# EAGLE design TestV2 (EAGLE 9.2.2)

## Sheet 1 of 8: Light Sensor Circuit
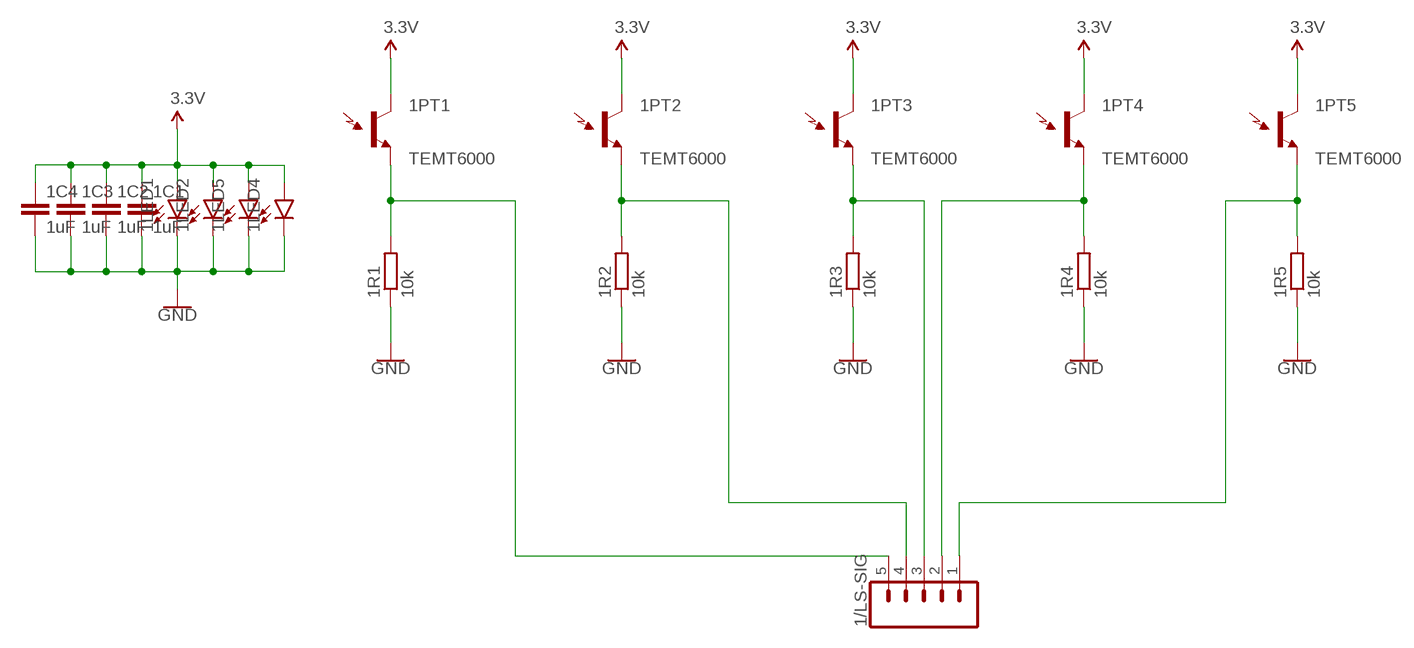
[diagram p0: schematic, sheet 1]

### Parts
1/LS-SIG  CONN_05LOCK  [1X05_LOCK]
1C1  1uF  C-EUC0603  [C0603]
1C2  1uF  C-EUC0603  [C0603]
1C3  1uF  C-EUC0603  [C0603]
1C4  1uF  C-EUC0603  [C0603]
1LED1  3528LED  [3528]
1LED2  3528LED  [3528]
1LED4  3528LED  [3528]
1LED5  3528LED  [3528]
1PT1  TEMT6000  LIGHT_SENSORTEMT6000  [TEMT6000]
1PT2  TEMT6000  LIGHT_SENSORTEMT6000  [TEMT6000]
1PT3  TEMT6000  LIGHT_SENSORTEMT6000  [TEMT6000]
1PT4  TEMT6000  LIGHT_SENSORTEMT6000  [TEMT6000]
1PT5  TEMT6000  LIGHT_SENSORTEMT6000  [TEMT6000]
1R1  10k  R-EU_R0603  [R0603]
1R2  10k  R-EU_R0603  [R0603]
1R3  10k  R-EU_R0603  [R0603]
1R4  10k  R-EU_R0603  [R0603]
1R5  10k  R-EU_R0603  [R0603]

### Nets
3.3V: 1C1.1 1C2.1 1C3.1 1C4.1 1LED1.A 1LED2.A 1LED4.A 1LED5.A 1PT1.COLLECTOR(C1) 1PT2.COLLECTOR(C1) 1PT3.COLLECTOR(C1) 1PT4.COLLECTOR(C1) 1PT5.COLLECTOR(C1) ; also sheet 2,3,5,6,7,8
GND: 1C1.2 1C2.2 1C3.2 1C4.2 1LED1.C 1LED2.C 1LED4.C 1LED5.C 1R1.1 1R2.1 1R3.1 1R4.1 1R5.1 ; also sheet 2,3,4,5,6,7,8
N$65: 1/LS-SIG.4 1PT2.EMITTER(E1) 1R2.2
N$66: 1/LS-SIG.3 1PT3.EMITTER(E1) 1R3.2
N$67: 1/LS-SIG.2 1PT4.EMITTER(E1) 1R4.2
N$68: 1/LS-SIG.1 1PT5.EMITTER(E1) 1R5.2
N$69: 1/LS-SIG.5 1PT1.EMITTER(E1) 1R1.2

## Sheet 2 of 8: TPS5450 Buck Circuit
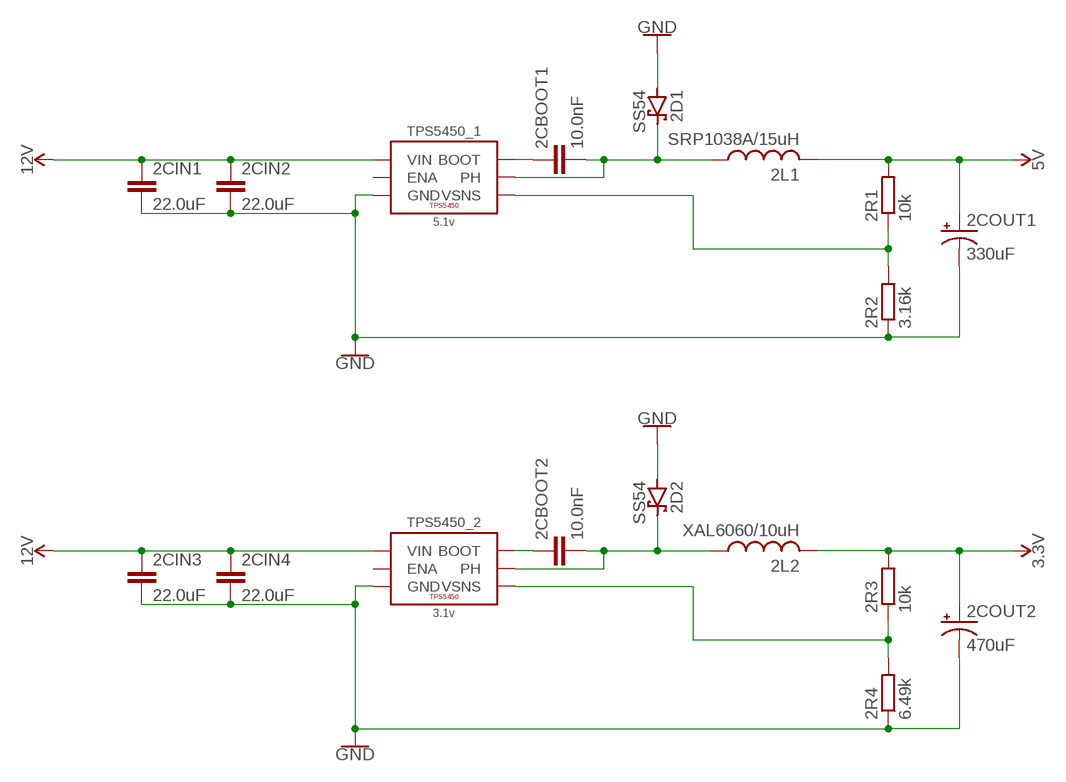
[diagram p1: schematic, sheet 2]

### Parts
2CBOOT1  10.0nF  C-EUC0603  [C0603]
2CBOOT2  10.0nF  C-EUC0603  [C0603]
2CIN1  22.0uF  C-EUC1210  [C1210]
2CIN2  22.0uF  C-EUC1210  [C1210]
2CIN3  22.0uF  C-EUC1210  [C1210]
2CIN4  22.0uF  C-EUC1210  [C1210]
2COUT1  330uF  CPOL-USD/7343-31R  [D/7343-31R]
2COUT2  470uF  CPOL-USD/7343-31R  [D/7343-31R]
2D1  SS54  SCHOTTKY-DIODESMD  [SMB]
2D2  SS54  SCHOTTKY-DIODESMD  [SMB]
2L1  SRP1038A/15uH  SRP1038A  [SRP1038A]
2L2  XAL6060/10uH  XAL6060  [XAL6060]
2R1  10k  R-EU_R0603  [R0603]
2R2  3.16k  R-EU_R0603  [R0603]
2R3  10k  R-EU_R0603  [R0603]
2R4  6.49k  R-EU_R0603  [R0603]
TPS5450_1  5.1v  TPS5450  [POWERPAD-SOIC-8]
TPS5450_2  3.1v  TPS5450  [POWERPAD-SOIC-8]

### Nets
3.3V: 2COUT2.+ 2L2.2 2R3.2 ; also sheet 1,3,5,6,7,8
5V: 2COUT1.+ 2L1.2 2R1.2 ; also sheet 3,6,8
12V: 2CIN1.1 2CIN2.1 2CIN3.1 2CIN4.1 TPS5450_1.7(VIN) TPS5450_2.7(VIN) ; also sheet 3,4,5,8
GND: 2CIN1.2 2CIN2.2 2CIN3.2 2CIN4.2 2COUT1.- 2COUT2.- 2D1.A 2D2.A 2R2.1 2R4.1 TPS5450_1.6(GND) TPS5450_1.9(GND) TPS5450_1.P$1(GND) TPS5450_1.P$2(GND) TPS5450_1.P$3(GND) TPS5450_1.P$4(GND) TPS5450_1.P$5(GND) TPS5450_1.P$6(GND) TPS5450_2.6(GND) TPS5450_2.9(GND) TPS5450_2.P$1(GND) TPS5450_2.P$2(GND) TPS5450_2.P$3(GND) TPS5450_2.P$4(GND) TPS5450_2.P$5(GND) TPS5450_2.P$6(GND) ; also sheet 1,3,4,5,6,7,8
N$1: 2CBOOT1.2 2D1.C 2L1.1 TPS5450_1.8(PH)
N$2: 2CBOOT2.1 TPS5450_2.1(BOOT)
N$3: 2CBOOT1.1 TPS5450_1.1(BOOT)
N$4: 2R1.1 2R2.2 TPS5450_1.4(VSNS)
N$5: 2CBOOT2.2 2D2.C 2L2.1 TPS5450_2.8(PH)
N$6: 2R3.1 2R4.2 TPS5450_2.4(VSNS)
Unconnected: TPS5450_1.2(NC) TPS5450_1.3(NC) TPS5450_1.5(ENA) TPS5450_2.2(NC) TPS5450_2.3(NC) TPS5450_2.5(ENA)

## Sheet 3 of 8: MAX1522 Boost Converter Circuit
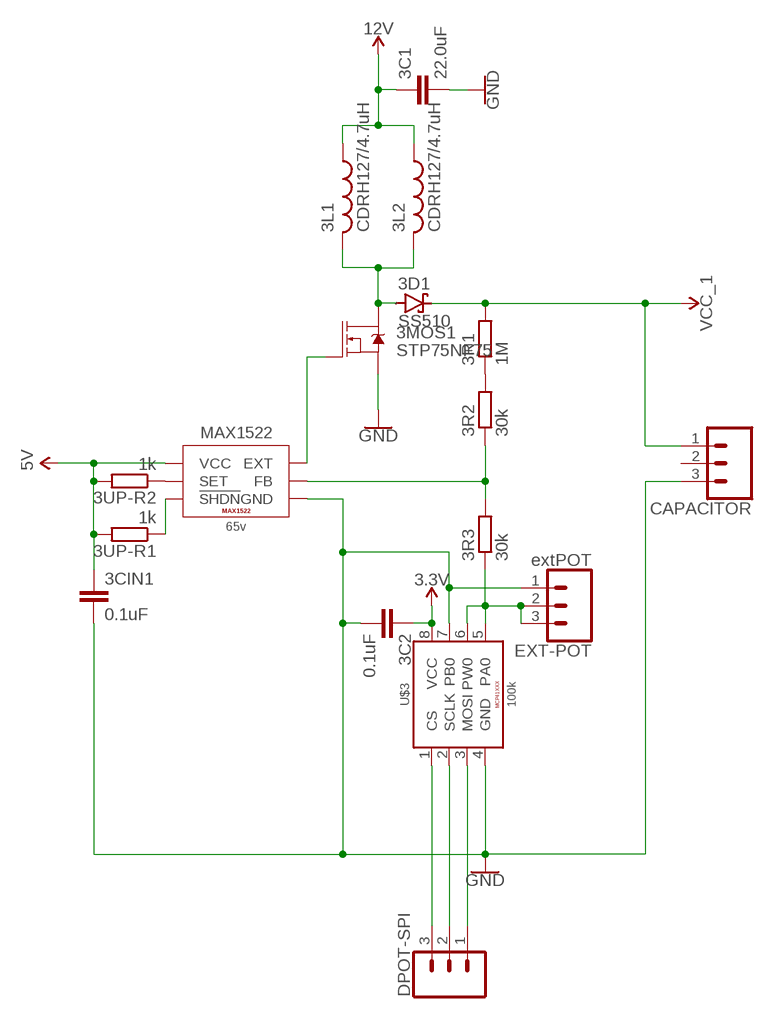
[diagram p2: schematic, sheet 3]

### Parts
3C1  22.0uF  C-EUC1210  [C1210]
3C2  0.1uF  C-EUC0603  [C0603]
3CIN1  0.1uF  C-EUC0603  [C0603]
3D1  SS510  SCHOTTKY-DIODESMD  [SMB]
3L1  CDRH127/4.7uH  CDRH127  [127]
3L2  CDRH127/4.7uH  CDRH127  [127]
3MOS1  STP75NF75  MOSFET-NCH-FQP30N06L  [TO220V]
3R1  1M  R-EU_R0603  [R0603]
3R2  30k  R-EU_R0603  [R0603]
3R3  30k  R-EU_R0603  [R0603]
3UP-R1  1k  R-EU_R0603  [R0603]
3UP-R2  1k  R-EU_R0603  [R0603]
CAPACITOR  CONN_03-SCREW-5MM  [SCREWTERMINAL-5MM-3]
DPOT-SPI  CONN_03LOCK  [1X03_LOCK]
EXT-POT  extPOT  CONN_03  [1X03]
MAX1522  65v  MAX1522EUT+T  [SOT23-6]
U$3  100k  MCP41XXX  [SOIC-8]

### Nets
3.3V: 3C2.1 U$3.8(VCC) ; also sheet 1,2,5,6,7,8
5V: 3CIN1.1 3UP-R1.2 3UP-R2.2 MAX1522.6(VCC) ; also sheet 2,6,8
12V: 3C1.1 3L1.1 3L2.1 ; also sheet 2,4,5,8
GND: 3C1.2 3C2.2 3CIN1.2 3MOS1.3(S) CAPACITOR.3 EXT-POT.1 MAX1522.1(GND) U$3.4(GND) U$3.7(PB0) ; also sheet 1,2,4,5,6,7,8
N$7: 3R1.1 3R2.2
N$8: 3R2.1 3R3.2 MAX1522.2(FB)
N$9: 3MOS1.1(G) MAX1522.5(EXT)
N$10: 3R3.1 EXT-POT.2 EXT-POT.3 U$3.5(PA0) U$3.6(PW0)
N$11: 3D1.A 3L1.2 3L2.2 3MOS1.2(D)
N$25: 3UP-R1.1 MAX1522.4(!SHDN)
N$29: 3UP-R2.1 MAX1522.3(SET)
N$37: DPOT-SPI.3 U$3.1(CS)
N$38: DPOT-SPI.2 U$3.2(SCLK)
N$39: DPOT-SPI.1 U$3.3(MOSI)
VCC_1: 3D1.C 3R1.2 CAPACITOR.1 ; also sheet 4
Unconnected: CAPACITOR.2

## Sheet 4 of 8: Solenoid MOSFET Switch Circuit
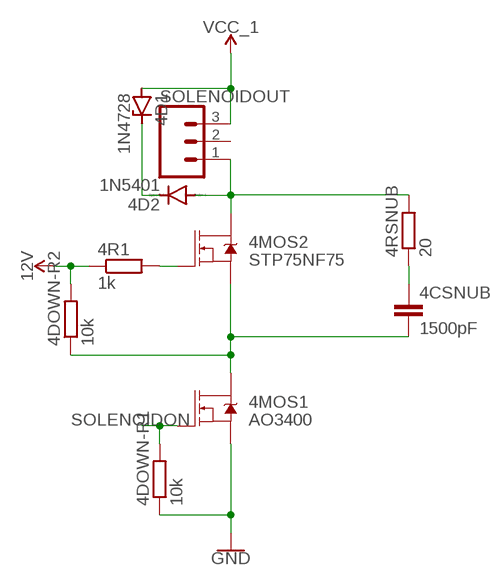
[diagram p3: schematic, sheet 4]

### Parts
4CSNUB  1500pF  C-EUC0603  [C0603]
4D1  1N4728  [DO41Z10]
4D2  1N5401  1N5400  [DO201-15]
4DOWN-R1  10k  R-EU_R0603  [R0603]
4DOWN-R2  10k  R-EU_R0603  [R0603]
4MOS1  AO3400  MOSFET-NCH-AO3404A  [SOT23-3]
4MOS2  STP75NF75  MOSFET-NCH-FQP30N06L  [TO220V]
4R1  1k  R-EU_R0603  [R0603]
4RSNUB  20  R-EU_R0603  [R0603]
SOLENOIDOUT  CONN_03-SCREW-5MM  [SCREWTERMINAL-5MM-3]

### Nets
12V: 4DOWN-R2.2 4R1.1 ; also sheet 2,3,5,8
GND: 4DOWN-R1.1 4MOS1.2(S) ; also sheet 1,2,3,5,6,7,8
N$22: 4CSNUB.2 4DOWN-R2.1 4MOS1.3(D) 4MOS2.3(S)
N$23: 4MOS2.1(G) 4R1.2
N$24: 4D1.C 4D2.C
N$26: 4CSNUB.1 4RSNUB.1
SOLENOID-: 4D2.A 4MOS2.2(D) 4RSNUB.2 SOLENOIDOUT.1
SOLENOIDON: 4DOWN-R1.2 4MOS1.1(G) ; also sheet 5
VCC_1: 4D1.A SOLENOIDOUT.3 ; also sheet 3
Unconnected: SOLENOIDOUT.2

## Sheet 5 of 8: VNH5050 Motor Driver Circuit
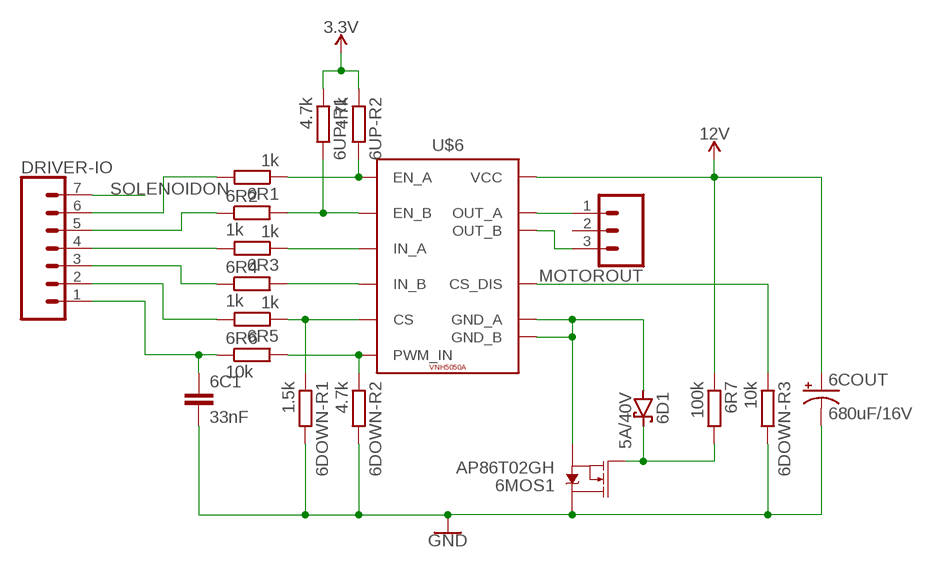
[diagram p4: schematic, sheet 5]

### Parts
6C1  33nF  C-EUC0603  [C0603]
6COUT  680uF/16V  CPOL-USE3.5-8  [E3,5-8]
6D1  5A/40V  SCHOTTKY-DIODESMD  [SMB]
6DOWN-R1  1.5k  R-EU_R0603  [R0603]
6DOWN-R2  4.7k  R-EU_R0603  [R0603]
6DOWN-R3  10k  R-EU_R0603  [R0603]
6MOS1  AP86T02GH  MOSFET-NCH-FDD8780  [DPAK]
6R1  1k  R-EU_R0603  [R0603]
6R2  1k  R-EU_R0603  [R0603]
6R3  1k  R-EU_R0603  [R0603]
6R4  1k  R-EU_R0603  [R0603]
6R5  1k  R-EU_R0603  [R0603]
6R6  10k  R-EU_R0603  [R0603]
6R7  100k  R-EU_R0603  [R0603]
6UP-R1  4.7k  R-EU_R0603  [R0603]
6UP-R2  4.7k  R-EU_R0603  [R0603]
DRIVER-IO  CONN_07LOCK  [1X07_LOCK]
MOTOROUT  CONN_03-SCREW-5MM  [SCREWTERMINAL-5MM-3]
U$6  VNH5050A  [POWERSSO-36]

### Nets
3.3V: 6UP-R1.1 6UP-R2.1 ; also sheet 1,2,3,6,7,8
12V: 6COUT.+ 6R7.1 U$6.1(VCC) U$6.P13(VCC) U$6.P24(VCC) U$6.P$13(VCC) U$6.P$14(VCC) U$6.P$15(VCC) U$6.P$16(VCC) U$6.P$17(VCC) U$6.P$18(VCC) U$6.P$19(VCC) U$6.P$20(VCC) U$6.P$21(VCC) U$6.P$22(VCC) U$6.P$23(VCC) U$6.P$24(VCC) ; also sheet 2,3,4,8
CS: 6R5.2 DRIVER-IO.2
EN_A: 6R1.2 DRIVER-IO.6
EN_B: 6R2.1 DRIVER-IO.5
GND: 6C1.2 6COUT.- 6DOWN-R1.2 6DOWN-R2.2 6DOWN-R3.2 6MOS1.4(D) ; also sheet 1,2,3,4,6,7,8
IN_A: 6R3.2 DRIVER-IO.4
IN_B: 6R4.1 DRIVER-IO.3
N$12: 6R1.1 6UP-R2.2 U$6.P16(EN_A)
N$13: 6R3.1 U$6.P15(IN_A)
N$14: 6R2.2 6UP-R1.2 U$6.P21(EN_B)
N$15: 6R4.2 U$6.P22(IN_B)
N$16: 6DOWN-R2.1 6R6.2 U$6.P17(PWM_IN)
N$17: 6DOWN-R1.1 6R5.1 U$6.P19(CS)
N$19: 6D1.A 6MOS1.3(S) U$6.P1(GND_A) U$6.P3(GND_A) U$6.P4(GND_A) U$6.P5(GND_A) U$6.P6(GND_A) U$6.P7(GND_A) U$6.P30(GND_B) U$6.P31(GND_B) U$6.P32(GND_B) U$6.P33(GND_B) U$6.P34(GND_B) U$6.P36(GND_B)
N$20: 6D1.C 6MOS1.1(G) 6R7.2
N$21: 6DOWN-R3.1 U$6.P20(CS_DIS)
N$32: MOTOROUT.1 U$6.2(OUT_A) U$6.P2(OUT_A) U$6.P8(OUT_A) U$6.P9(OUT_A) U$6.P10(OUT_A) U$6.P11(OUT_A) U$6.P12(OUT_A) U$6.P14(OUT_A) U$6.P$7(OUT_A) U$6.P$8(OUT_A) U$6.P$9(OUT_A) U$6.P$10(OUT_A) U$6.P$11(OUT_A) U$6.P$12(OUT_A)
N$33: MOTOROUT.3 U$6.3(OUT_B) U$6.P23(OUT_B) U$6.P25(OUT_B) U$6.P26(OUT_B) U$6.P27(OUT_B) U$6.P28(OUT_B) U$6.P29(OUT_B) U$6.P35(OUT_B) U$6.P$1(OUT_B) U$6.P$2(OUT_B) U$6.P$3(OUT_B) U$6.P$4(OUT_B) U$6.P$5(OUT_B) U$6.P$6(OUT_B)
PWM: 6C1.1 6R6.1 DRIVER-IO.1
SOLENOIDON: DRIVER-IO.7 ; also sheet 4
Unconnected: MOTOROUT.2 U$6.P18(NC)

## Sheet 6 of 8: IR
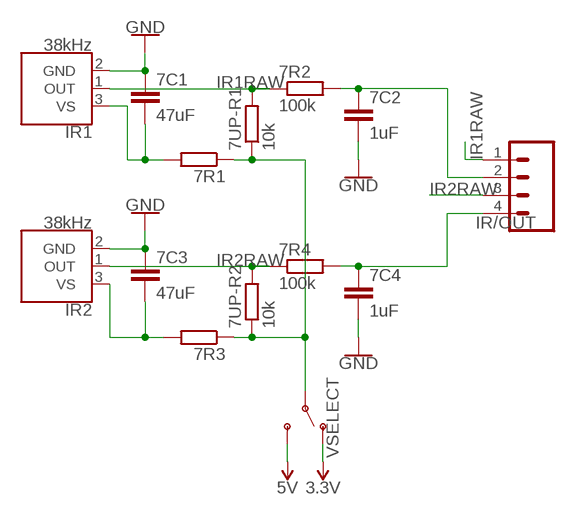
[diagram p5: schematic, sheet 6]

### Parts
7C1  47uF  C-EUC0603  [C0603]
7C2  1uF  C-EUC0603  [C0603]
7C3  47uF  C-EUC0603  [C0603]
7C4  1uF  C-EUC0603  [C0603]
7R1  R-EU_R0603  [R0603]
7R2  100k  R-EU_R0603  [R0603]
7R3  R-EU_R0603  [R0603]
7R4  100k  R-EU_R0603  [R0603]
7UP-R1  10k  R-EU_R0603  [R0603]
7UP-R2  10k  R-EU_R0603  [R0603]
IR1  38kHz  TSOP38238  [TSOP382]
IR2  38kHz  TSOP38238  [TSOP382]
IR/OUT  CONN_04LOCK  [1X04_LOCK]
VSELECT  SWITCH-SPDT-PTH-11.6X4.0MM-LOCK  [SWITCH_SPDT_PTH_11.6X4.0MM_LOCK]

### Nets
3.3V: VSELECT.1(O) ; also sheet 1,2,3,5,7,8
5V: VSELECT.3(S) ; also sheet 2,3,8
GND: 7C1.1 7C2.2 7C3.1 7C4.2 IR1.2(GND) IR2.2(GND) ; also sheet 1,2,3,4,5,7,8
IR1RAW: 7R2.1 7UP-R1.2 IR1.1(OUT) IR/OUT.1
IR2RAW: 7R4.1 7UP-R2.2 IR2.1(OUT) IR/OUT.3
N$34: 7C1.2 7R1.2 IR1.3(VS)
N$35: 7R1.1 7R3.1 7UP-R1.1 7UP-R2.1 VSELECT.2(P)
N$41: 7C2.1 7R2.2 IR/OUT.2
N$43: 7C3.2 7R3.2 IR2.3(VS)
N$44: 7C4.1 7R4.2 IR/OUT.4

## Sheet 7 of 8: PMW3360 Mouse Sensor
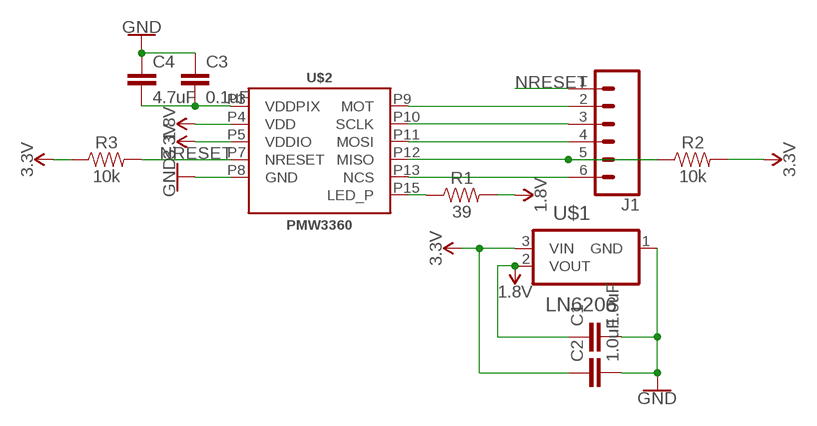
[diagram p6: schematic, sheet 7]

### Parts
C1  1.0uF  1.0UF-0603-16V-10%-X7R  [0603]
C2  1.0uF  1.0UF-0603-16V-10%-X7R  [0603]
C3  0.1uF  0.1UF-0603-25V-5%  [0603]
C4  4.7uF  4.7UF-0603-6.3V-(10%)  [0603]
J1  CONN_06LOCK  [1X06_LOCK]
R1  39  RESISTOR0603  [0603]
R2  10k  10KOHM-0603-1/10W-1%  [0603]
R3  10k  10KOHM-0603-1/10W-1%  [0603]
U$1  LN6206  MCP1700T-3302E/TT  [SOT95P237X112-3N]
U$2  PMW3360  [PMW3360]

### Nets
1.8V: C1.1 R1.2 U$1.2(VOUT) U$2.P4(VDD)
3.3V: C2.1 R2.2 R3.1 U$1.3(VIN) U$2.P5(VDDIO) ; also sheet 1,2,3,5,6,8
GND: C1.2 C2.2 C3.1 C4.1 U$1.1(GND) U$2.P8(GND) ; also sheet 1,2,3,4,5,6,8
N$36: R1.1 U$2.P15(LED_P)
N$40: J1.6 U$2.P13(NCS)
N$42: J1.5 R2.1 U$2.P12(MISO)
N$45: J1.4 U$2.P11(MOSI)
N$46: J1.3 U$2.P10(SCLK)
N$47: J1.2 U$2.P9(MOT)
N$48: C3.2 C4.2 U$2.P3(VDDPIX)
NRESET: J1.1 R3.2 U$2.P7(NRESET)
Unconnected: U$2.P1 U$2.P2 U$2.P6 U$2.P14 U$2.P16

## Sheet 8 of 8: Power Input / Outputs
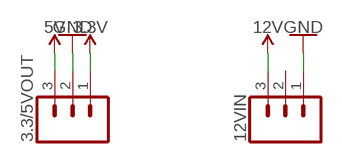
[diagram p7: schematic, sheet 8]

### Parts
3.3/5VOUT  CONN_03-SCREW-5MM  [SCREWTERMINAL-5MM-3]
12VIN  CONN_03-SCREW-5MM  [SCREWTERMINAL-5MM-3]

### Nets
3.3V: 3.3/5VOUT.1 ; also sheet 1,2,3,5,6,7
5V: 3.3/5VOUT.3 ; also sheet 2,3,6
12V: 12VIN.3 ; also sheet 2,3,4,5
GND: 3.3/5VOUT.2 12VIN.1 ; also sheet 1,2,3,4,5,6,7
Unconnected: 12VIN.2

## Library data of the parts
1/LS-SIG = SparkFun-Connectors:CONN_05: Multi connection point. Often used as Generic Header-pin footprint for 0.1 inch spaced/style header connections On any of the 0.1 inch spaced packages, you can populate with these: Break Away Headers - Straight <https://www.sparkfun.com/products/116> (PRT-00116) Break Away Male Headers - Right Angle <https://www.sparkfun.com/products/553> (PRT-00553) Female Headers <https://www.sparkfun.com/products/115> (PRT-00115) Break Away Headers - Machine Pin <https://www.sparkfun.com/products/117> (PRT-00117) Break Away Female Headers - Swiss Machine Pin <https://www.sparkfun.com/products/743> (PRT-00743) For SCREWTERMINALS and SPRING TERMINALS visit here: Screw Terimnals on SparkFun.com <https://www.sparkfun.com/search/results?term=Screw+Terminals> (5mm/3.5mm/2.54mm spacing) This device is also useful as a general connection point to wire up your design to another part of your project. Our various solder wires solder well into these plated through hole pads. Hook-Up Wire - Assortment (Stranded, 22 AWG) <https://www.sparkfun.com/products/11375> (PRT-11375) Hook-Up Wire - Assortment (Solid Core, 22 AWG) <https://www.sparkfun.com/products/11367> (PRT-11367) View the entire wire category on our website here <https://www.sparkfun.com/categories/141> Special notes: Molex polarized connector foot print use with SKU : PRT-08231 with associated crimp pins and housings. 1MM SMD Version SKU: PRT-10208
1C1-1C4 2CBOOT1 2CBOOT2 2CIN1-2CIN4 3C1 3C2 3CIN1 4CSNUB 6C1 7C1-7C4 = rcl:C-EU: CAPACITOR, European symbol; SPICEPREFIX: C
1LED1 1LED2 1LED4 1LED5 = JH:3528LED
1PT1-1PT5 = SparkFun-Sensors:LIGHT_SENSOR: Ambient Light Sensors - Phototransistors Low cost ambient light sensors, consisting of a phototransistor in miniature SMD packages. Output voltage varies with light intensity. SparkFun Products ALS-PT19 Light Sensor <https://www.sparkfun.com/products/12566> (SEN-12566) Ambient Light Sensor - TEMT6000 <https://www.sparkfun.com/products/8348> (SEN-08348) SparkFun Ambient Light Sensor Breakout - TEMT60000 <https://www.sparkfun.com/products/8688> (SEN-08688); PROD_ID: COMP-08569; SF_ID: COM-08348
1R1-1R5 2R1-2R4 3R1-3R3 3UP-R1 3UP-R2 4DOWN-R1 4DOWN-R2 4R1 4RSNUB 6DOWN-R1-6DOWN-R3 6R1-6R7 6UP-R1 6UP-R2 7R1-7R4 7UP-R1 7UP-R2 = rcl:R-EU_: RESISTOR, European symbol; SPICEPREFIX: R
2COUT1 2COUT2 6COUT = rcl:CPOL-US: POLARIZED CAPACITOR, American symbol; SPICEPREFIX: C
2D1 2D2 3D1 6D1 = diode:SCHOTTKY-DIODE: Schottky Diode
2L1 = JH:SRP1038A
2L2 = JH:XAL6060
3.3/5VOUT 12VIN CAPACITOR MOTOROUT SOLENOIDOUT = SparkFun-Connectors:CONN_03: Multi connection point. Often used as Generic Header-pin footprint for 0.1 inch spaced/style header connections On any of the 0.1 inch spaced packages, you can populate with these: Break Away Headers - Straight <https://www.sparkfun.com/products/116> (PRT-00116) Break Away Male Headers - Right Angle <https://www.sparkfun.com/products/553> (PRT-00553) Female Headers <https://www.sparkfun.com/products/115> (PRT-00115) Break Away Headers - Machine Pin <https://www.sparkfun.com/products/117> (PRT-00117) Break Away Female Headers - Swiss Machine Pin <https://www.sparkfun.com/products/743> (PRT-00743) Stackable Header - 3 Pin (Female, 0.1") <https://www.sparkfun.com/products/13875> (PRT-13875) For SCREWTERMINALS and SPRING TERMINALS visit here: Screw Terimnals on SparkFun.com <https://www.sparkfun.com/search/results?term=Screw+Terminals> (5mm/3.5mm/2.54mm spacing) This device is also useful as a general connection point to wire up your design to another part of your project. Our various solder wires solder well into these plated through hole pads. Hook-Up Wire - Assortment (Stranded, 22 AWG) <https://www.sparkfun.com/products/11375> (PRT-11375) Hook-Up Wire - Assortment (Solid Core, 22 AWG) <https://www.sparkfun.com/products/11367> (PRT-11367) View the entire wire category on our website here <https://www.sparkfun.com/categories/141> Special notes: Molex polarized connector foot print use with SKU : PRT-08232 with associated crimp pins and housings.; PROD_ID: CONN-10134; SF_SKU: PRT-08433
3L1 3L2 = JH:CDRH127
3MOS1 4MOS2 = SparkFun-DiscreteSemi:MOSFET-NCH: N-channel MOSFETs Voltage controlled devices that allow control of high current outputs. SparkFun Products: SparkFun OpenScale <https://www.sparkfun.com/products/13261> SparkFun Digital Sandbox <https://www.sparkfun.com/products/12651> SparkFun Monster Moto Shield <https://www.sparkfun.com/products/10182> SparkFun MOSFET Power Controller <https://www.sparkfun.com/products/11214>; PROD_ID: TRANS-10060; VALUE: 60V/32A/35mΩ
4D1 = diode:1N4728: Z DIODE 3.3 V, 1W, 5 percent
4D2 = diode:1N5400: DIODE standard rectifier, 3 A, 50 V (Motorola)
4MOS1 = SparkFun-DiscreteSemi:MOSFET-NCH: N-channel MOSFETs Voltage controlled devices that allow control of high current outputs. SparkFun Products: SparkFun OpenScale <https://www.sparkfun.com/products/13261> SparkFun Digital Sandbox <https://www.sparkfun.com/products/12651> SparkFun Monster Moto Shield <https://www.sparkfun.com/products/10182> SparkFun MOSFET Power Controller <https://www.sparkfun.com/products/11214>; PROD_ID: TRANS-12988; VALUE: 5.8A/30V/35mΩ
6MOS1 = SparkFun-DiscreteSemi:MOSFET-NCH: N-channel MOSFETs Voltage controlled devices that allow control of high current outputs. SparkFun Products: SparkFun OpenScale <https://www.sparkfun.com/products/13261> SparkFun Digital Sandbox <https://www.sparkfun.com/products/12651> SparkFun Monster Moto Shield <https://www.sparkfun.com/products/10182> SparkFun MOSFET Power Controller <https://www.sparkfun.com/products/11214>; PROD_ID: TRANS-09984; VALUE: 35A/25V/8.5mΩ
C1 C2 = SparkFun-Capacitors:1.0UF: 1µF ceramic capacitors A capacitor is a passive two-terminal electrical component used to store electrical energy temporarily in an electric field.; PROD_ID: CAP-13930
C3 = SparkFun-Capacitors:0.1UF: 0.1µF ceramic capacitors A capacitor is a passive two-terminal electrical component used to store electrical energy temporarily in an electric field.; PROD_ID: CAP-08604
C4 = SparkFun-Capacitors:4.7UF: 4.7µF ceramic capacitors A capacitor is a passive two-terminal electrical component used to store electrical energy temporarily in an electric field.; PROD_ID: CAP-08280
DPOT-SPI = SparkFun-Connectors:CONN_03: Multi connection point. Often used as Generic Header-pin footprint for 0.1 inch spaced/style header connections On any of the 0.1 inch spaced packages, you can populate with these: Break Away Headers - Straight <https://www.sparkfun.com/products/116> (PRT-00116) Break Away Male Headers - Right Angle <https://www.sparkfun.com/products/553> (PRT-00553) Female Headers <https://www.sparkfun.com/products/115> (PRT-00115) Break Away Headers - Machine Pin <https://www.sparkfun.com/products/117> (PRT-00117) Break Away Female Headers - Swiss Machine Pin <https://www.sparkfun.com/products/743> (PRT-00743) Stackable Header - 3 Pin (Female, 0.1") <https://www.sparkfun.com/products/13875> (PRT-13875) For SCREWTERMINALS and SPRING TERMINALS visit here: Screw Terimnals on SparkFun.com <https://www.sparkfun.com/search/results?term=Screw+Terminals> (5mm/3.5mm/2.54mm spacing) This device is also useful as a general connection point to wire up your design to another part of your project. Our various solder wires solder well into these plated through hole pads. Hook-Up Wire - Assortment (Stranded, 22 AWG) <https://www.sparkfun.com/products/11375> (PRT-11375) Hook-Up Wire - Assortment (Solid Core, 22 AWG) <https://www.sparkfun.com/products/11367> (PRT-11367) View the entire wire category on our website here <https://www.sparkfun.com/categories/141> Special notes: Molex polarized connector foot print use with SKU : PRT-08232 with associated crimp pins and housings.
DRIVER-IO = SparkFun-Connectors:CONN_07: Multi connection point. Often used as Generic Header-pin footprint for 0.1 inch spaced/style header connections On any of the 0.1 inch spaced packages, you can populate with these: Break Away Headers - Straight <https://www.sparkfun.com/products/116> (PRT-00116) Break Away Male Headers - Right Angle <https://www.sparkfun.com/products/553> (PRT-00553) Female Headers <https://www.sparkfun.com/products/115> (PRT-00115) Break Away Headers - Machine Pin <https://www.sparkfun.com/products/117> (PRT-00117) Break Away Female Headers - Swiss Machine Pin <https://www.sparkfun.com/products/743> (PRT-00743) For SCREWTERMINALS and SPRING TERMINALS visit here: Screw Terimnals on SparkFun.com <https://www.sparkfun.com/search/results?term=Screw+Terminals> (5mm/3.5mm/2.54mm spacing) This device is also useful as a general connection point to wire up your design to another part of your project. Our various solder wires solder well into these plated through hole pads. Hook-Up Wire - Assortment (Stranded, 22 AWG) <https://www.sparkfun.com/products/11375> (PRT-11375) Hook-Up Wire - Assortment (Solid Core, 22 AWG) <https://www.sparkfun.com/products/11367> (PRT-11367) View the entire wire category on our website here <https://www.sparkfun.com/categories/141> Special notes: Molex polarized connector foot print use with SKU : PRT-08231 with associated crimp pins and housings. 1MM SMD Version SKU: PRT-10208 NOTES ON THE VARIANTS LOCK and LOCK_LONGPADS... This footprint was designed to help hold the alignment of a through-hole component (i.e. 6-pin header) while soldering it into place. You may notice that each hole has been shifted either up or down by 0.005 of an inch from it's more standard position (which is a perfectly straight line). This slight alteration caused the pins (the squares in the middle) to touch the edges of the holes. Because they are alternating, it causes a "brace" to hold the component in place. 0.005 has proven to be the perfect amount of "off-center" position when using our standard breakaway headers. Although looks a little odd when you look at the bare footprint, once you have a header in there, the alteration is very hard to notice. Also,if you push a header all the way into place, it is covered up entirely on the bottom side.
EXT-POT = SparkFun-Connectors:CONN_03: Multi connection point. Often used as Generic Header-pin footprint for 0.1 inch spaced/style header connections On any of the 0.1 inch spaced packages, you can populate with these: Break Away Headers - Straight <https://www.sparkfun.com/products/116> (PRT-00116) Break Away Male Headers - Right Angle <https://www.sparkfun.com/products/553> (PRT-00553) Female Headers <https://www.sparkfun.com/products/115> (PRT-00115) Break Away Headers - Machine Pin <https://www.sparkfun.com/products/117> (PRT-00117) Break Away Female Headers - Swiss Machine Pin <https://www.sparkfun.com/products/743> (PRT-00743) Stackable Header - 3 Pin (Female, 0.1") <https://www.sparkfun.com/products/13875> (PRT-13875) For SCREWTERMINALS and SPRING TERMINALS visit here: Screw Terimnals on SparkFun.com <https://www.sparkfun.com/search/results?term=Screw+Terminals> (5mm/3.5mm/2.54mm spacing) This device is also useful as a general connection point to wire up your design to another part of your project. Our various solder wires solder well into these plated through hole pads. Hook-Up Wire - Assortment (Stranded, 22 AWG) <https://www.sparkfun.com/products/11375> (PRT-11375) Hook-Up Wire - Assortment (Solid Core, 22 AWG) <https://www.sparkfun.com/products/11367> (PRT-11367) View the entire wire category on our website here <https://www.sparkfun.com/categories/141> Special notes: Molex polarized connector foot print use with SKU : PRT-08232 with associated crimp pins and housings.; PROD_ID: XXX-00000; VALUE: 455-1750-1-ND
IR1 IR2 = SparkFun-Sensors:TSOP382: Vishay Semiconductor TSOP32838 - 38kHz IR Receiver These products are miniaturized IR receiver modules for infrared remote control systems. A PIN diode and a preamplifier are assembled on a leadframe, the epoxy package contains an IR filter. The demodulated output signal can be directly connected to a microprocessor for decoding.; PROD_ID: SEN-10266
IR/OUT = SparkFun-Connectors:CONN_04: Multi connection point. Often used as Generic Header-pin footprint for 0.1 inch spaced/style header connections On any of the 0.1 inch spaced packages, you can populate with these: Break Away Headers - Straight <https://www.sparkfun.com/products/116> (PRT-00116) Break Away Male Headers - Right Angle <https://www.sparkfun.com/products/553> (PRT-00553) Female Headers <https://www.sparkfun.com/products/115> (PRT-00115) Break Away Headers - Machine Pin <https://www.sparkfun.com/products/117> (PRT-00117) Break Away Female Headers - Swiss Machine Pin <https://www.sparkfun.com/products/743> (PRT-00743) For SCREWTERMINALS and SPRING TERMINALS visit here: Screw Terimnals on SparkFun.com <https://www.sparkfun.com/search/results?term=Screw+Terminals> (5mm/3.5mm/2.54mm spacing) This device is also useful as a general connection point to wire up your design to another part of your project. Our various solder wires solder well into these plated through hole pads. Hook-Up Wire - Assortment (Stranded, 22 AWG) <https://www.sparkfun.com/products/11375> (PRT-11375) Hook-Up Wire - Assortment (Solid Core, 22 AWG) <https://www.sparkfun.com/products/11367> (PRT-11367) View the entire wire category on our website here <https://www.sparkfun.com/categories/141> Special notes: Molex polarized connector foot print use with SKU : PRT-08231 with associated crimp pins and housings. 1MM SMD Version SKU: PRT-10208; PROD_ID: CONN-09696
J1 = SparkFun-Connectors:CONN_06: Multi connection point. Often used as Generic Header-pin footprint for 0.1 inch spaced/style header connections On any of the 0.1 inch spaced packages, you can populate with these: Break Away Headers - Straight <https://www.sparkfun.com/products/116> (PRT-00116) Break Away Male Headers - Right Angle <https://www.sparkfun.com/products/553> (PRT-00553) Female Headers <https://www.sparkfun.com/products/115> (PRT-00115) Break Away Headers - Machine Pin <https://www.sparkfun.com/products/117> (PRT-00117) Break Away Female Headers - Swiss Machine Pin <https://www.sparkfun.com/products/743> (PRT-00743) Arduino Stackable Header - 6 Pin <https://www.sparkfun.com/products/9280> (PRT-09280) For SCREWTERMINALS and SPRING TERMINALS visit here: Screw Terimnals on SparkFun.com <https://www.sparkfun.com/search/results?term=Screw+Terminals> (5mm/3.5mm/2.54mm spacing) This device is also useful as a general connection point to wire up your design to another part of your project. Our various solder wires solder well into these plated through hole pads. Hook-Up Wire - Assortment (Stranded, 22 AWG) <https://www.sparkfun.com/products/11375> (PRT-11375) Hook-Up Wire - Assortment (Solid Core, 22 AWG) <https://www.sparkfun.com/products/11367> (PRT-11367) View the entire wire category on our website here <https://www.sparkfun.com/categories/141>
MAX1522 = JH:MAX1522EUT+T; MANUFACTURER_PART_NUMBER: MAX1522EUT+T; VENDOR: MAXIM
R1 = SparkFun-Resistors:RESISTOR: Generic Resistor Package
R2 R3 = SparkFun-Resistors:10KOHM: 10kΩ resistor A resistor is a passive two-terminal electrical component that implements electrical resistance as a circuit element. Resistors act to reduce current flow, and, at the same time, act to lower voltage levels within circuits. - Wikipedia; PROD_ID: RES-00824
TPS5450_1 TPS5450_2 = JH:TPS5450
U$1 = MCP1700T-3302E_TT:MCP1700T-3302E/TT: Low Quiescent Current LDO; AVAILABILITY: Unavailable; DESCRIPTION: MCP1700 Series 250 mA 3.3 V Fixed Output LDO Voltage Regulator - SOT-23; MF: Microchip; MP: MCP1700T-3302E/TT; PACKAGE: SOT-23-3 Microchip; PRICE: None
U$2 = JH:PMW3360
U$3 = JH:MCP41XXX
U$6 = JH:VNH5050A
VSELECT = SparkFun-Switches:SWITCH-SPDT: Single Pole, Double Throw (SPDT) Switch Single-pole, double-throw (SPDT) switch. Variant Overview SMD-AYZ0202 Surface Mount DPDT Switch <https://www.sparkfun.com/products/597> (COM-00597) Used on e.g. LilyPad Arduino USB - ATmega32U4 Board <https://www.sparkfun.com/products/12049> PTH-11.6X4.0MM SPDT Mini Power Switch <https://www.sparkfun.com/products/102> (COM-00102) Used on e.g. SparkFun Simon Says - Through-Hole Soldering Kit <https://www.sparkfun.com/products/10547> (KIT-10547) PTH-11.6X4.0MM-KIT KIT version of SPDT Mini Power Switch - Simplifies soldering by removing tStop of switch pins - only one side can be soldered. PTH-11.6X4.0MM-LOCK LOCK version of SPDT Mini Power Switch - Offset pins hold switch in place for easier soldering. SMD-RIGHT-ANGLE Surface Mount Right Angle Switch <https://www.sparkfun.com/products/10860> (COM-10860) Used on e.g. SparkFun ESP8266 Thing <https://www.sparkfun.com/products/13231>; PROD_ID: SWCH-08261; SF_SKU: COM-00102

## Board
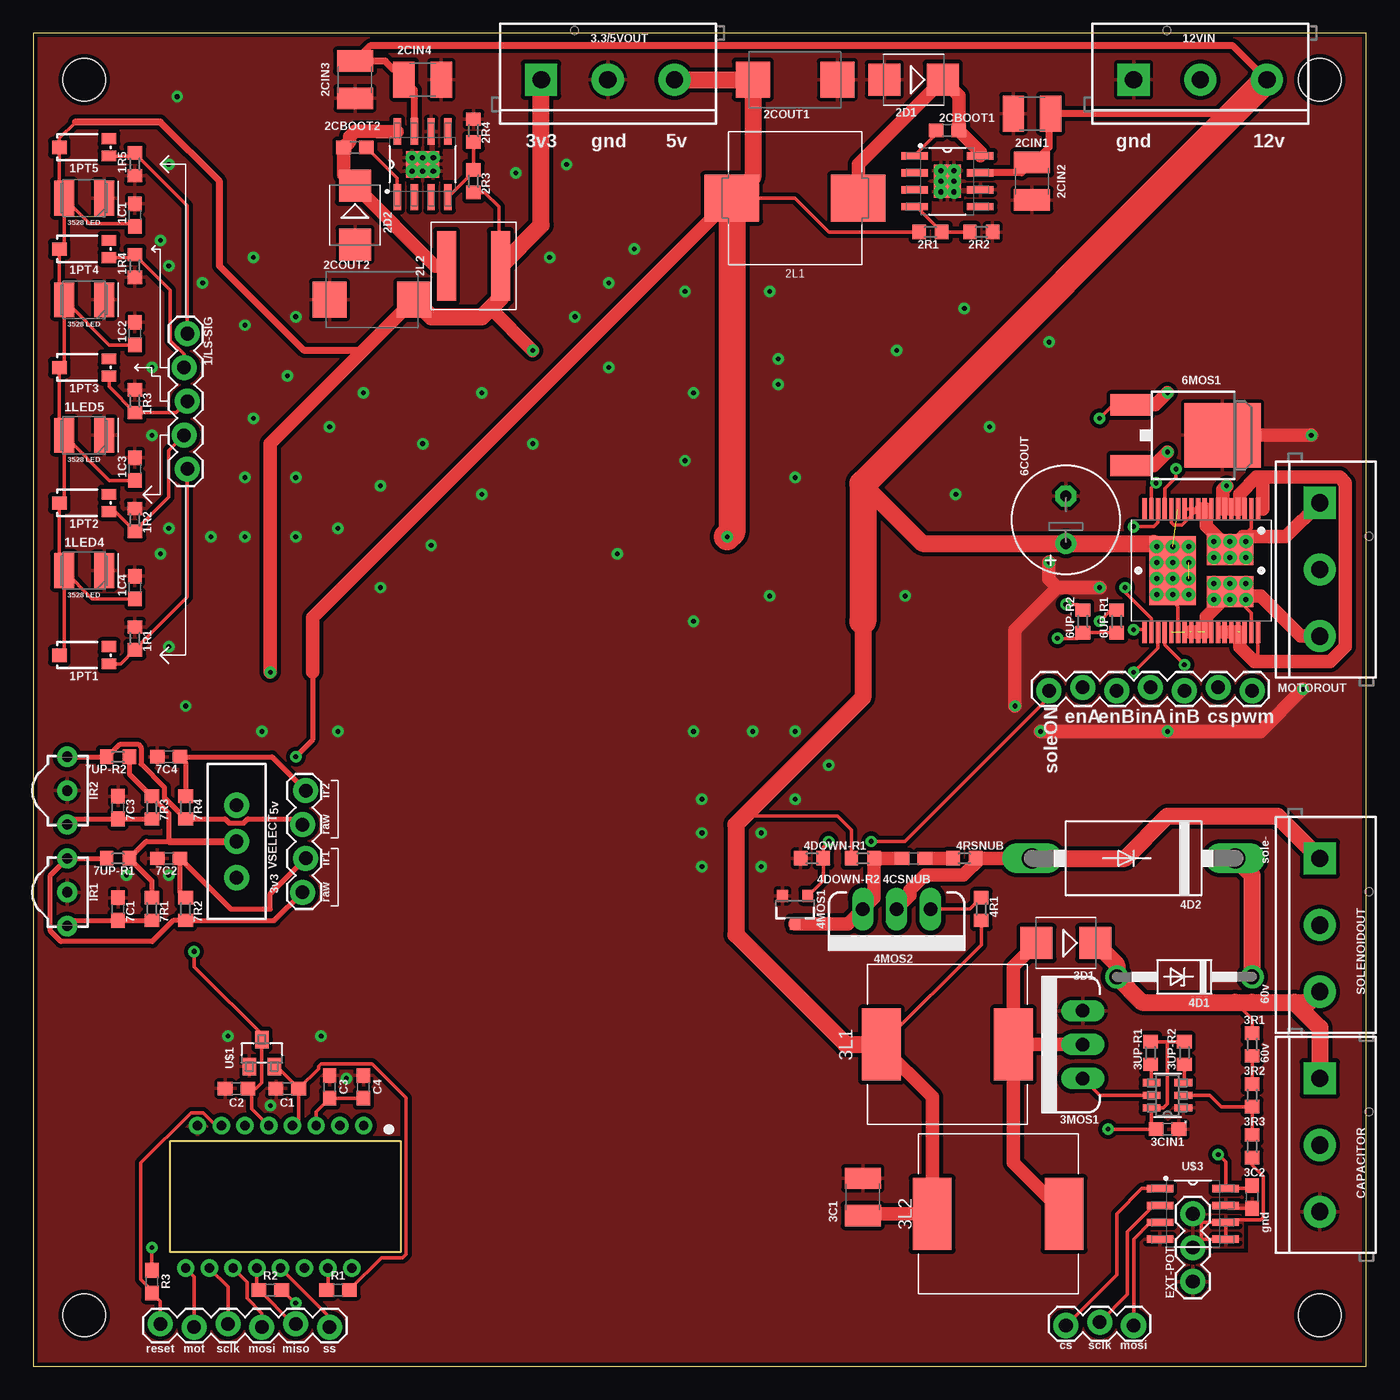
[diagram p8: board, top side]
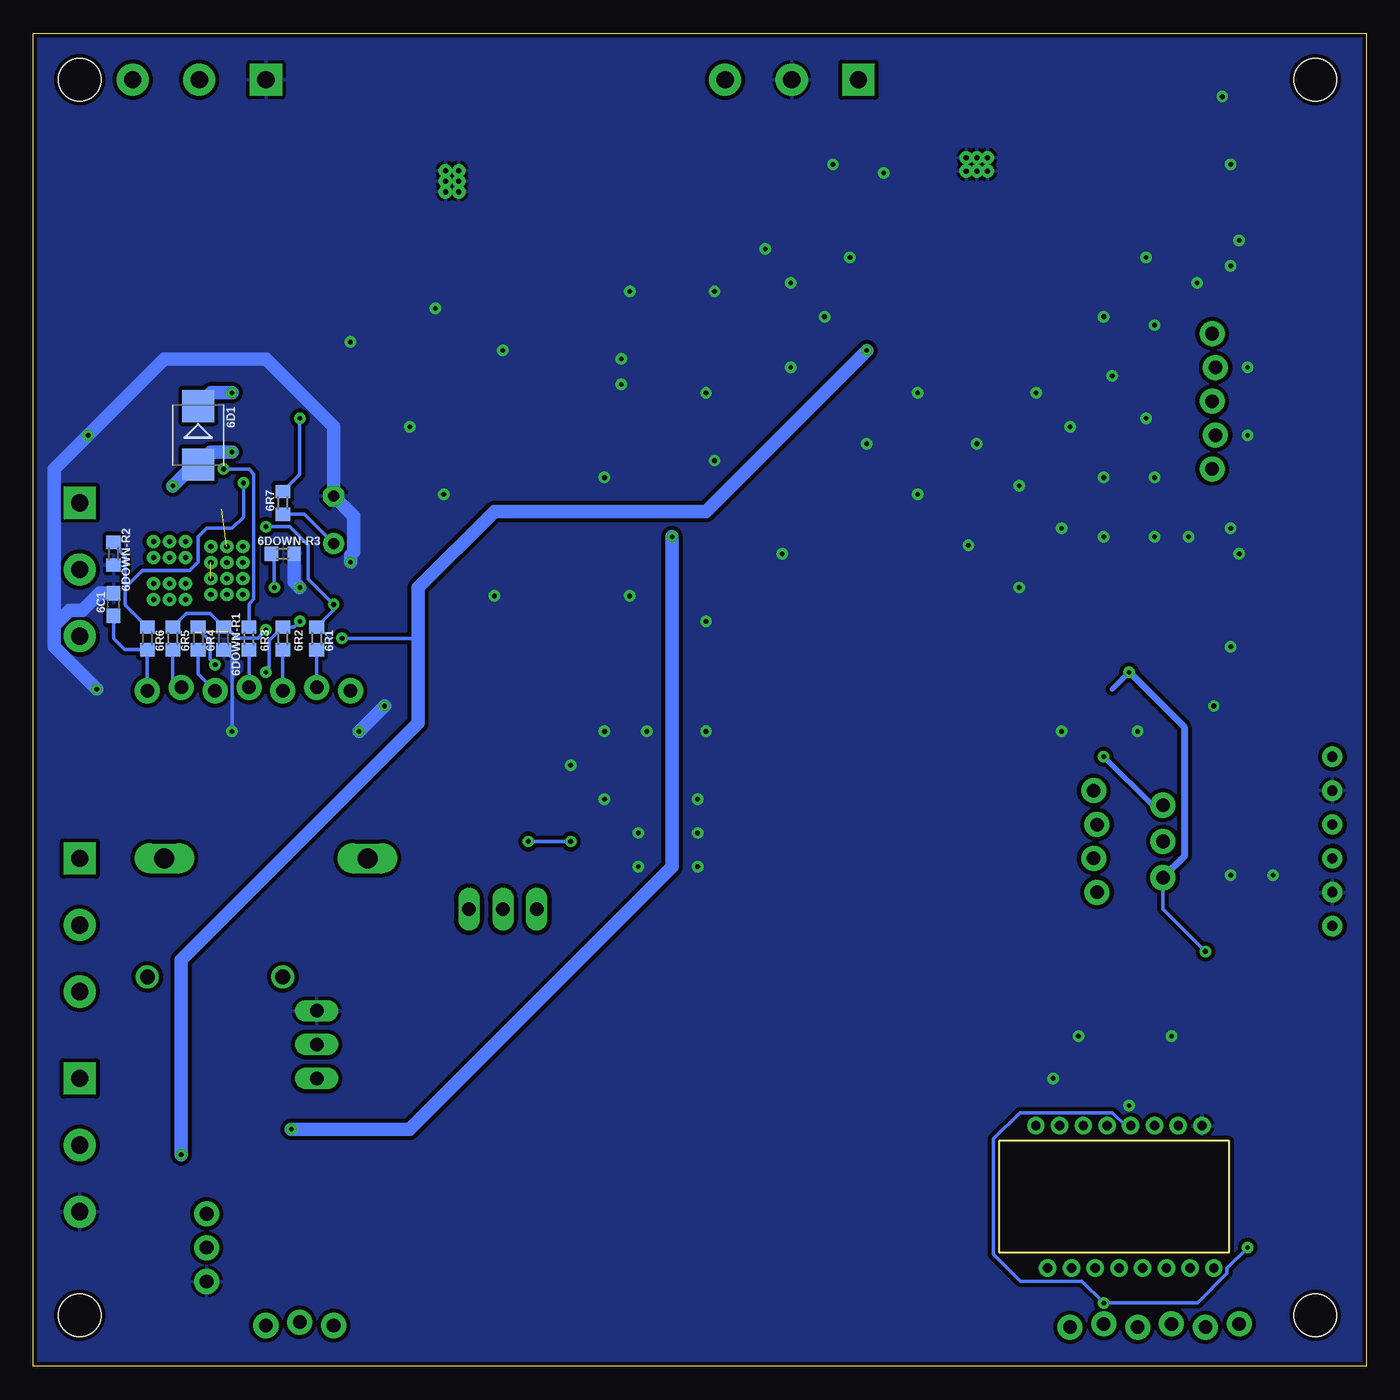
[diagram p9: board, bottom side, seen from below]

Size 100 x 100 mm. Coordinates in mm from the lower left corner, seen from the top.
Outline: 0,0 100,0 100,100 0,100 0,0
Outline: 27.55,16.89 27.55,8.54 10.29,8.54 10.29,16.89 27.55,16.89
Copper layers (1*16): Top 0.035mm / dielectric 1.5mm / Bottom 0.035mm
Design rules "mine *": minimum track width 10mil, minimum drill 10mil, track to track 8mil, track to pad 8mil, pad to pad 8mil, via to via 8mil, smd to smd 8mil, copper to edge 8mil, drill to drill 8mil, minimum pad ring 12mil, minimum via ring 10mil, stop-mask expansion 4mil, vias tented up to drill 25mil, thermal gap 10mil
Holes 3.2 mm at 3.81,96.52 96.52,96.52 96.52,3.81 3.81,3.81
Milling: 4 lines

### Footprints (pad centres in the part's own frame; a part is rotated, then mirrored left to right if it is on the bottom)
1X05_LOCK = drill 1.016 pad 1.88: 1 0,0.127; 2 2.54,-0.127; 3 5.08,0.127; 4 7.62,-0.127; 5 10.16,0.127
C0603 = smd 1.1 x 1: 1 -0.85,0; 2 0.85,0
3528 = smd 1.5 x 2.6: A -1.5,0; C 1.5,0
TEMT6000 = smd 1.1 x 0.8: BASE -1.87,-0.65; EMITTER -1.87,0.65 | smd 1.1 x 1: COLLECTOR 1.86,0.01
R0603 = smd 1 x 1.1: 1 -0.85,0; 2 0.85,0
C1210 = smd 1.6 x 2.7: 1 -1.4,0; 2 1.4,0
D/7343-31R = smd 2.55 x 2.7: + 3.175,0; - -3.175,0
SMB = smd 2.4 x 2.4: A 2.2,0; C -2.2,0
SRP1038A = smd 4.1 x 3.5: 1 -4.75,0; 2 4.75,0
XAL6060 = smd 1.43 x 5.24: 1 -2.02,0; 2 2.02,0
SCREWTERMINAL-5MM-3 = drill 1.3 pad 2.413 square: 1 0,0 | drill 1.3 pad 2.413: 2 5,0; 3 10,0
127 = smd 5.4 x 2.9: 1 0,4.95; 2 0,-4.95
TO220V = drill 1.016 long: 1 -2.54,0; 2 0,0; 3 2.54,0
DO41Z10 = drill 1.118: A 5.08,0; C -5.08,0
DO201-15 = drill 1.499 long: A 7.62,0; C -7.62,0
SOT23-3 = smd 0.8 x 0.9: 1 -0.95,-1; 2 0.95,-1; 3 0,1.1
E3,5-8 = drill 0.813 pad 1.6: + -1.778,0 | drill 0.813 pad 1.6 octagon: - 1.778,0
DPAK = smd 1.6 x 3: 1 -2.28,-5.31; 3 2.28,-5.31 | smd 4.826 x 5.715: 4 0,1.588
0603 = smd 1.1 x 1: 1 -0.85,0; 2 0.85,0
1X03_LOCK = drill 1.016 pad 1.88: 1 0,0.127; 2 2.54,-0.127; 3 5.08,0.127
1X07_LOCK = drill 1.016 pad 1.88: 1 0,0.127; 2 2.54,-0.127; 3 5.08,0.127; 4 7.62,-0.127; 5 10.16,0.127; 6 12.7,-0.127; 7 15.24,0.127
1X03 = drill 1.016 pad 1.88: 1 0,0; 2 2.54,0; 3 5.08,0
TSOP382 = drill 0.762 pad 1.524: 1 -2.54,0; 2 0,0; 3 2.54,0
1X04_LOCK = drill 1.016 pad 1.88: 1 0,0.127; 2 2.54,-0.127; 3 5.08,0.127; 4 7.62,-0.127
1X06_LOCK = drill 1.016 pad 1.88: 1 0,0; 2 2.54,-0.254; 3 5.08,0; 4 7.62,-0.254; 5 10.16,0; 6 12.7,-0.254
SOT23-6 = smd 1.321 x 0.559: 1 -1.194,0.94; 2 -1.194,0; 3 -1.194,-0.94; 4 1.194,-0.94; 5 1.194,0; 6 1.194,0.94
POWERPAD-SOIC-8 = smd 1.981 x 0.559: 1 -2.464,1.905; 2 -2.464,0.635; 3 -2.464,-0.635; 4 -2.464,-1.905; 5 2.464,-1.905; 6 2.464,-0.635; 7 2.464,0.635; 8 2.464,1.905 | smd 2.007 x 2.489: 9 0,0 | drill 0.381: P$1 -0.5,0.8; P$2 0.5,0.8; P$3 -0.5,0; P$4 0.5,0; P$5 -0.5,-0.8; P$6 0.5,-0.8
SOT95P237X112-3N = smd 0.991 x 1.321: 1 -0.94,-1.016; 2 0.94,-1.016; 3 0,1.016
PMW3360 = drill 0.7: P1 13.35,5.34; P2 11.57,5.34; P3 9.79,5.34; P4 8.01,5.34; P5 6.23,5.34; P6 4.45,5.34; P7 2.67,5.34; P8 0.89,5.34; P9 0,-5.34; P10 1.78,-5.34; P11 3.56,-5.34; P12 5.34,-5.34; P13 7.12,-5.34; P14 8.9,-5.34; P15 10.68,-5.34; P16 12.46,-5.34
SOIC-8 = smd 1.981 x 0.559: 1 -2.464,1.905; 2 -2.464,0.635; 3 -2.464,-0.635; 4 -2.464,-1.905; 5 2.464,-1.905; 6 2.464,-0.635; 7 2.464,0.635; 8 2.464,1.905
POWERSSO-36 = smd 3.5 x 5.2: 1 2.15,0 | smd 3.5 x 2.35: 2 -2.15,-1.575; 3 -2.15,1.575 | smd 0.32 x 1.7: P1 -4.25,-4.6; P2 -3.75,-4.6; P3 -3.25,-4.6; P4 -2.75,-4.6; P5 -2.25,-4.6; P6 -1.75,-4.6; P7 -1.25,-4.6; P8 -0.75,-4.6; P9 -0.25,-4.6; P10 0.25,-4.6; P11 0.75,-4.6; P12 1.25,-4.6; P13 1.75,-4.6; P14 2.25,-4.6; P15 2.75,-4.6; P16 3.25,-4.6; P17 3.75,-4.6; P18 4.25,-4.6; P19 4.25,4.6; P20 3.75,4.6; P21 3.25,4.6; P22 2.75,4.6; P23 2.25,4.6; P24 1.75,4.6; P25 1.25,4.6; P26 0.75,4.6; P27 0.25,4.6; P28 -0.25,4.6; P29 -0.75,4.6; P30 -1.25,4.6; P31 -1.75,4.6; P32 -2.25,4.6; P33 -2.75,4.6; P34 -3.25,4.6; P35 -3.75,4.6; P36 -4.25,4.6 | drill 0.381: P$1 -3.35,2.175; P$2 -2.15,2.175; P$3 -0.95,2.175; P$4 -0.95,0.975; P$5 -2.15,0.975; P$6 -3.35,0.975; P$7 -3.35,-0.975; P$8 -2.15,-2.175; P$9 -3.35,-2.175; P$10 -2.15,-0.975; P$11 -0.95,-0.975; P$12 -0.95,-2.175; P$13 0.952,1.802; P$14 2.152,0.602; P$15 2.152,1.802; P$16 3.352,1.802; P$17 3.352,0.602; P$18 0.952,0.602; P$19 0.952,-0.598; P$20 2.152,-0.598; P$21 3.352,-0.598; P$22 3.352,-1.798; P$23 2.152,-1.798; P$24 0.952,-1.798
SWITCH_SPDT_PTH_11.6X4.0MM_LOCK = drill 1.016 pad 1.88: 1 0,2.718; 2 0,0; 3 0,-2.718

### Placement (x,y rotation side)
1/LS-SIG  11.43,77.47 270 top
1C1  7.62,86.36 90 top
1C2  7.62,77.47 90 top
1C3  7.62,67.31 90 top
1C4  7.62,58.42 90 top
1LED1  3.81,87.63 0 top
1LED2  3.81,80.01 0 top
1LED4  3.81,59.69 0 top
1LED5  3.81,69.85 0 top
1PT1  3.81,53.34 180 top
1PT2  3.81,64.77 180 top
1PT3  3.81,74.93 180 top
1PT4  3.81,83.82 180 top
1PT5  3.81,91.44 180 top
1R1  7.62,54.61 270 top
1R2  7.62,63.5 270 top
1R3  7.62,72.39 270 top
1R4  7.62,82.55 90 top
1R5  7.62,90.17 90 top
2CBOOT1  68.58,92.71 0 top
2CBOOT2  24.13,91.44 180 top
2CIN1  74.93,93.98 180 top
2CIN2  74.93,88.9 270 top
2CIN3  24.13,96.52 270 top
2CIN4  29.21,96.52 0 top
2COUT1  57.15,96.52 180 top
2COUT2  25.4,80.01 0 top
2D1  66.04,96.52 180 top
2D2  24.13,86.36 270 top
2L1  57.15,87.63 180 top
2L2  33.02,82.55 0 top
2R1  67.31,85.09 180 top
2R2  71.12,85.09 180 top
2R3  33.02,88.9 270 top
2R4  33.02,92.71 270 top
3.3/5VOUT  38.1,96.52 0 top
3C1  62.23,12.7 90 top
3C2  91.44,12.7 270 top
3CIN1  85.09,17.78 0 top
3D1  77.47,31.75 180 top
3L1  68.58,24.13 90 top
3L2  72.39,11.43 90 top
3MOS1  78.74,24.13 90 top
3R1  91.44,24.13 90 top
3R2  91.44,20.32 90 top
3R3  91.44,16.51 90 top
3UP-R1  83.82,23.5 90 top
3UP-R2  86.36,23.5 90 top
4CSNUB  66.04,38.1 180 top
4D1  86.36,29.21 180 top
4D2  82.55,38.1 180 top
4DOWN-R1  58.42,38.1 0 top
4DOWN-R2  62.23,38.1 180 top
4MOS1  57.15,34.29 180 top
4MOS2  64.77,34.29 180 top
4R1  71.12,34.29 90 top
4RSNUB  69.85,38.1 0 top
6C1  93.98,57.15 90 bottom
6COUT  77.47,63.5 90 top
6D1  87.63,69.85 270 bottom
6DOWN-R1  85.72,54.61 270 bottom
6DOWN-R2  93.98,60.96 270 bottom
6DOWN-R3  81.28,60.96 0 bottom
6MOS1  87.63,69.85 270 top
6R1  78.74,54.61 270 bottom
6R2  81.28,54.61 90 bottom
6R3  83.82,54.61 270 bottom
6R4  87.63,54.61 90 bottom
6R5  89.53,54.61 270 bottom
6R6  91.44,54.61 90 bottom
6R7  81.28,64.77 90 bottom
6UP-R1  81.28,55.88 90 top
6UP-R2  78.74,55.88 90 top
7C1  6.35,34.29 270 top
7C2  10.16,38.1 180 top
7C3  6.35,41.91 270 top
7C4  10.16,45.72 180 top
7R1  8.89,34.29 270 top
7R2  11.43,34.29 90 top
7R3  8.89,41.91 270 top
7R4  11.43,41.91 90 top
7UP-R1  6.35,38.1 180 top
7UP-R2  6.35,45.72 180 top
12VIN  82.55,96.52 0 top
C1  19.05,20.83 180 top
C2  15.24,20.83 180 top
C3  22.23,20.95 270 top
C4  24.77,20.95 270 top
CAPACITOR  96.52,21.59 270 top
DPOT-SPI  82.55,3.17 180 top
DRIVER-IO  91.44,50.8 180 top
EXT-POT  87,6.35 90 top
IR1  2.54,35.56 270 top
IR2  2.54,43.18 270 top
IR/OUT  20.32,35.56 90 top
J1  9.53,3.17 0 top
MAX1522  85.09,20.32 180 top
MOTOROUT  96.52,64.77 270 top
R1  22.86,5.71 0 top
R2  17.78,5.71 0 top
R3  8.89,6.35 270 top
SOLENOIDOUT  96.52,38.1 270 top
TPS5450_1  68.58,88.9 0 top
TPS5450_2  29.21,90.17 90 top
U$1  17.14,23.5 0 top
U$2  11.43,12.7 0 top
U$3  87,11.43 0 top
U$6  87.63,59.69 180 top
VSELECT  15.24,39.37 180 top

### Tracks (layer width: path | path; a pad name or v marks a point on that pad's centre or on a via)
1.8V
  Top 0.254: C1.1 19.9,18.5 U$2.P4 | C1.1 18.25,22.48 U$1.2 | R1.2 26.13,8.14 27.71,8.14 27.95,8.38 27.95,20.14 25.4,22.68 21.59,22.68 21.39,22.49 21.39,22.32 C1.1
3.3V  (via drill 0.35)
  Top 0.254: 2L2.2 34.92,82.67 34.92,87 33.87,88.05 2R3.2 | 3.17,93.34 1.95,92.12 1PT5.COLLECTOR 1.95,87.99 1LED1.A | 1LED1.A 2.31,84.17 1PT4.COLLECTOR 1.95,80.37 1LED2.A | 1LED1.A 4.21,85.72 7.41,85.72 1C1.1 | 1LED2.A 2.31,75.28 1PT3.COLLECTOR 1.95,70.21 1LED5.A | 1LED2.A 5.7,76.62 1C2.1 | 1LED5.A 2.31,65.12 1PT2.COLLECTOR 1.95,60.05 1LED4.A | 1LED5.A 5.7,66.46 1C3.1 | 1LED4.A 4.43,57.57 1C4.1 | 1LED4.A 2.31,53.69 1PT1.COLLECTOR | 3C2.1 91.22,13.34 U$3.8 89.46,15.32 v88.9,15.88 | v76.83,54.61 78.32,54.61 6UP-R2.1 6UP-R1.1 | U$2.P5 16.39,19.31 16.39,20.53 C2.1 16.73,20.83 17.14,21.25 U$1.3 17.53,24.51 12.06,29.97 v12.06,31.11 | R2.2 19.6,4.75 v19.68,4.75 | v8.89,8.89 R3.1
  Top 0.508: 2COUT2.+ 24.77,76.2 20.32,76.2 13.97,82.55 13.97,88.9 9.53,93.34 3.17,93.34
  Top 1.016: 2COUT2.+ 17.78,69.22 v17.78,52.07 | 34.29,79.38 v37.47,76.2
  Top 1.27: 3.3/5VOUT.1 38.1,85.61 2L2.2 35.04,80.12 34.29,79.38 33.66,78.74 29.84,78.74 2COUT2.+
  Bottom 0.254: 71.12,54.61 v76.83,54.61 | U$2.P5 18.05,18.04 19.03,19.02 25.99,19.02 27.95,17.06 27.95,8.38 25.95,6.38 21.31,6.38 v19.68,4.75 12.65,4.75 10.45,6.95 10.45,7.33 v8.89,8.89 | VSELECT.1 15.24,34.29 v12.06,31.11
  Bottom 0.381: v17.78,52.07 19.05,50.8
  Bottom 0.508: v17.78,52.07 13.65,47.94 13.65,38.24 VSELECT.1
  Bottom 1.016: v37.47,76.2 49.53,64.14 65.41,64.14 71.12,58.42 71.12,54.61 71.12,48.26 88.9,30.48 v88.9,15.88
5V  (via drill 0.35)
  Top 0.254: 2L1.2 57.15,87.63 59.69,85.09 2R1.2 | 3UP-R2.2 85.09,24.34 | 85.09,24.34 3UP-R1.2 | 85.09,24.34 85.09,19.68 84.78,19.38 MAX1522.6 83.9,18.12 3CIN1.1 v80.64,17.78
  Top 0.381: 20.95,52.07 20.95,46.99 v19.68,45.72
  Top 1.016: 2L1.2 20.95,56.19 20.95,52.07
  Top 1.27: 3.3/5VOUT.3 2COUT1.+ 53.98,89.2 2L1.2
  Top 2.032: 2L1.2 52.4,62.56 v52.07,62.23
  Bottom 0.381: v19.68,45.72 16.05,42.09 VSELECT.3
  Bottom 1.016: v52.07,62.23 52.07,37.47 71.75,17.78 v80.64,17.78
12V  (3 unrouted)
  Top 0.254: 3L1.1 71.12,31.62 4R1.1 | 53.34,41.27 60.33,41.27 61.38,40.22 4DOWN-R2.2 | 85.62,60.43 U$6.P$20 | 85.62,60.43 U$6.P$24 | U$6.1 86.08,60.29 U$6.P$19 | U$6.1 84.88,59.69 U$6.P$17 | U$6.1 U$6.P$14 | U$6.1 U$6.P$15 | U$6.1 84.28,58.49 U$6.P$16 | U$6.1 U$6.P$14 U$6.P$13 | U$6.1 85.48,57.4 85.88,56.99 U$6.P24 | U$6.1 U$6.P$23 | U$6.1 84.88,60.29 U$6.P$21 | U$6.P$20 84.04,61.72 | U$6.1 85.62,59.83 85.62,60.43 | U$6.1 U$6.P$20
  Top 0.508: TPS5450_2.7 28.57,95.75 2CIN4.1 26.41,97.92 2CIN3.1 25.27,99.06 90.01,99.06 12VIN.3 90.01,93.98 2CIN1.1 76.2,93.85 76.2,91.44 75.06,90.3 2CIN2.1 74.17,89.53 TPS5450_1.7
  Top 1.016: 3C1.1 62.36,11.43 3L2.1 67.44,20.19 63.63,24 3L1.1
  Top 1.27: 62.23,55.88 62.23,50.16 53.34,41.27 52.7,40.64 52.7,32.38 60.96,24.13 3L1.1 | 62.23,66.2 66.71,61.72 6COUT.+ 84.04,61.72 U$6.P$22
  Top 2.032: 12VIN.3 62.23,66.2 62.23,55.88
  Bottom 0.254: 6R7.1 79.67,63.92 6COUT.+
CS
  Bottom 0.254: 6R5.2 89.53,51.56 DRIVER-IO.2
EN_A
  Bottom 0.254: 6R1.2 DRIVER-IO.6
EN_B
  Bottom 0.254: 6R2.1 DRIVER-IO.5
GND  (via drill 0.35)
  Top 0.254: U$3.7 89.67,11.85 3C2.2
  Top 1.016: v80.01,58.42 76.83,58.42 | 76.83,58.42 76.2,59.05 v76.2,60.33 | 76.83,58.42 73.66,55.24 v73.66,49.53 | v75.56,47.62 v85.09,47.62 92.08,47.62 v95.25,50.8 | v95.89,69.85 6MOS1.4
  Bottom 0.254: 6DOWN-R1.2 85.09,53.12 v85.09,47.62
  Bottom 1.016: 6DOWN-R3.2 80.43,58.84 v80.01,58.42 | v76.2,60.33 76.2,60.85 75.96,61.1 75.96,63.77 6COUT.- 77.47,70.48 82.55,75.56 90.17,75.56 v95.89,69.85 98.44,67.3 98.44,55.56 | v73.66,49.53 v75.56,47.62 | 98.44,55.56 98.44,53.98 97.31,52.85 97.3,52.85 v95.25,50.8 | 98.44,55.56 97.31,56.69 96.35,56.69 95.03,58 6C1.2
  other vias: 49.53,47.62 53.98,47.62 57.15,47.62 59.69,45.09 57.15,42.55 54.61,40.01 54.61,37.47 50.16,37.47 50.16,40.01 50.16,42.55 10.79,95.25 10.16,90.17 9.53,84.45 8.89,74.93 8.89,69.85 9.53,60.96 10.16,53.98 6.99,36.83 10.16,36.83 15.88,78.11 12.7,81.28 10.16,82.55 10.16,62.87 13.34,62.23 15.88,62.23 15.88,66.67 16.51,71.12 19.05,74.3 19.68,78.74 16.51,83.19 24.77,73.03 22.23,70.48 19.68,66.67 19.68,62.23 22.86,62.87 26.04,66.04 29.21,69.22 33.66,73.03 37.47,69.22 33.66,65.41 29.84,61.59 26.04,58.42 40.64,78.74 43.18,74.93 43.18,81.28 45.09,83.82 48.9,80.64 49.53,73.03 55.88,73.66 55.88,75.56 55.24,80.64 64.77,76.2 69.85,79.38 76.2,76.83 71.75,70.48 36.2,89.53 38.73,83.19 40.01,90.17 48.9,67.94 43.81,60.96 49.53,55.88 55.24,57.78 57.15,66.67 65.41,57.78 69.22,65.41 22.86,47.62 17.14,47.62 11.43,49.53 21.59,24.77 14.61,24.77 23.5,21.59 17.78,19.56
  pour Bottom (isolate 0.305): 0,100 100,100 100,0 0,0
  pour Top (isolate 0.305, rank 2): 0,100 100,100 100,0 0,0
IN_A
  Bottom 0.254: 6R3.2 DRIVER-IO.4
IN_B
  Bottom 0.254: 6R4.1 87.63,51.94 DRIVER-IO.3
IR1RAW
  Top 0.381: 7UP-R1.2 IR1.1 1.27,36.83 1.27,32.66 2.06,31.86 8.92,31.86 10.5,33.44 7R2.1 18.07,33.44 IR/OUT.1
IR2RAW
  Top 0.381: IR2.1 7UP-R2.2 5.59,45.72 6.54,46.66 7.86,46.66 8.09,46.43 8.09,45.16 9.83,43.42 9.83,42.66 7R4.1 14.38,41.06 14.69,40.75 15.79,40.75 16.1,41.06 19.77,41.06 IR/OUT.3
N$1
  Top 1.016: TPS5450_1.8 71.04,91.1 2CBOOT1.2 69.43,95.33 2D1.C 61.9,90.18 2L1.1
N$2
  Top 0.254: 2CBOOT2.1 27.3,89.11 TPS5450_2.1
N$3
  Top 0.254: TPS5450_1.1 67.73,92.42 2CBOOT1.1
N$4
  Top 0.254: 2R2.2 2R1.1 66.25,87 TPS5450_1.4
N$5
  Top 1.016: TPS5450_2.8 25.84,92.63 25.82,92.65 24.14,92.65 23.72,92.23 23.72,91.88 2CBOOT2.2 23.28,89.41 2D2.C 30.14,82.55 2L2.1
N$6
  Top 0.254: TPS5450_2.4 33.02,89.61 2R3.1 2R4.2
N$7
  Top 0.254: 3R2.2 3R1.1
N$8
  Top 0.254: 3R3.2 3R2.1 89.11,19.47 88.27,20.32 MAX1522.2
N$9
  Top 0.254: 3MOS1.1 80.01,20.32 MAX1522.5
N$10
  Top 0.254: 87.63,10.79 U$3.6 | EXT-POT.2 87.63,9.53 | 87.63,9.53 U$3.5 U$3.6 | EXT-POT.3 87.63,10.79 | 87.63,10.79 87.63,9.53 | 3R3.1 91.44,15.07 92.27,14.24 92.27,11.16 92.08,10.97 89.63,10.97 U$3.6
  pour Top (isolate 0.305): 86.36,12.06 86.36,8.26 87.63,8.26 88.27,8.89 90.81,8.89 90.81,11.43 88.27,11.43 87.63,11.43 87,12.06
N$11
  Top 1.016: 3L1.2 3MOS1.2 | 3L1.2 73.53,15.24 3L2.2 | 3L1.2 73.53,30.01 3D1.A
N$12  (via drill 0.35)
  Top 0.254: v77.47,57.15 78.32,57.15 6UP-R2.2 | U$6.P16 84.37,63.3 84.06,62.99 v82.55,62.99
  Bottom 0.254: 6R1.1 77.47,56.73 v77.47,57.15 79.38,59.05 79.38,61.59 80.77,62.99 v82.55,62.99
N$13  (via drill 0.35)
  Top 0.254: v85.72,67.31 85.72,66.67 84.88,65.83 U$6.P15
  Bottom 0.254: 6R3.1 83.82,57.18 83.45,57.55 83.45,66.94 83.82,67.31 v85.72,67.31
N$14  (via drill 0.35)
  Top 0.254: v80.01,55.88 80.86,56.73 6UP-R1.2 | v82.55,52.07 84.38,53.9 U$6.P21
  Bottom 0.254: v80.01,55.88 80.43,55.46 6R2.2 82.3,54.44 82.3,52.32 v82.55,52.07
N$15  (via drill 0.35)
  Top 0.254: v86.36,52.63 84.88,54.11 U$6.P22
  Bottom 0.254: 6R4.2 87.63,55.28 86.75,54.4 86.75,53.02 v86.36,52.63
N$16  (via drill 0.35)
  Top 0.254: v84.24,66.26 83.88,65.9 U$6.P17
  Bottom 0.254: 6DOWN-R2.1 93.98,61.63 93.1,60.75 93.1,58.42 | 6R6.2 93.1,57.12 93.1,58.42 | 93.1,58.42 91.83,59.69 88.27,59.69 87.63,60.33 87.63,62.23 87,62.87 85.09,62.87 84.24,63.72 v84.24,66.26
N$17  (via drill 0.35)
  Top 0.254: U$6.P19 83.22,55.25 v82.56,55.25
  Bottom 0.254: 6R5.1 88.52,56.48 86.74,56.48 6DOWN-R1.1 85.54,55.46 84.71,54.63 83.13,54.63 82.94,54.82 82.94,54.87 v82.56,55.25
N$19  (via drill 0.35)  (1 unrouted)
  Top 0.254: 92.08,52.85 91.88,53.05 U$6.P36 | 90.51,64.29 U$6.P3 | 89.25,64.29 U$6.P7 89.53,64.29 | U$6.P6 90.17,64.29 | U$6.P5 U$6.P4 | 92.25,64.29 U$6.P1 | U$6.P30 89.25,55.09 U$6.P31 | U$6.P33 U$6.P34 | U$6.P32 89.92,55.09
  Top 1.016: 6MOS1.3 84.08,67.57 v85.09,68.58 | v89.53,66.04 89.25,65.76 89.25,64.29 89.53,64.29 90.17,64.29 U$6.P4 | 90.51,64.29 U$6.P4 | U$6.P4 90.51,64.42 90.51,65.44 91.76,66.69 | 91.76,66.69 98.02,66.69 98.44,66.27 98.44,63.27 98.42,63.26 98.42,60.58 98.44,60.56 98.44,53.98 97.31,52.85 92.08,52.85 91.6,52.85 90.51,53.95 90.51,55.09 89.92,55.09 89.25,55.09 | 91.76,66.69 92.25,66.2 92.25,64.29
  Bottom 1.016: v85.09,68.58 86.7,68.58 6D1.A 87.92,67.65 v89.53,66.04
N$20  (via drill 0.35)
  Top 0.254: 6MOS1.1 81.02,72.13 v80.01,71.12
  Top 1.016: 6MOS1.1 84.19,72.13 v85.09,73.03
  Bottom 0.254: 6R7.2 80.01,66.89 v80.01,71.12
  Bottom 1.016: v85.09,73.03 86.66,73.03 6D1.C
N$21  (via drill 0.35)
  Top 0.254: U$6.P20 83.87,56.08 81.92,58.03 v81.92,58.42
  Bottom 0.254: v81.92,58.42 81.92,60.74 6DOWN-R3.1
N$22
  Top 1.016: 4MOS1.3 61.13,33.19 4MOS2.3 63.08,35.14 4DOWN-R2.1 4CSNUB.2
N$23
  Top 0.254: 4R1.2 70.27,34.29 4MOS2.1
N$24
  Top 1.27: 4D1.C 91.44,36.83 4D2.C
N$25
  Top 0.254: 3UP-R1.1 83.9,22.57 MAX1522.4
N$26
  Top 1.016: 4CSNUB.1 4RSNUB.1
N$29
  Top 0.254: 3UP-R2.1 86.36,21.34 MAX1522.3
N$32
  Top 0.254: U$6.2 91.38,62.87 U$6.P2 | U$6.P10 87.36,64.29 86.18,63.11 85.58,63.11 85.39,63.3 U$6.P14 | U$6.P12 U$6.P11 U$6.P10 | U$6.P10 87.63,64.29 | U$6.P8 U$6.P9 88.01,64.16 88.01,63.5 | U$6.2 U$6.P$10 | U$6.2 89.18,60.66 U$6.P$11 | 90.38,61.27 U$6.P$9 | U$6.2 90.38,61.27 | 90.38,61.27 U$6.P$7 | U$6.2 U$6.P$8 | U$6.2 89.18,61.87 U$6.P$12
  Top 1.016: MOTOROUT.1 93.98,62.23 90.75,62.23 U$6.2 88.01,63.04 88.01,63.5 88.01,64.29 87.63,64.29
N$33  (3 unrouted)
  Top 0.254: U$6.P35 91.38,56.52 U$6.3 | U$6.3 89.18,57.52 U$6.P$3 89.18,58.12 U$6.3 | U$6.3 U$6.P$5 | U$6.3 89.78,58.05 90.05,57.78 | U$6.3 90.38,58.12 U$6.P$6 | U$6.3 90.38,57.52 U$6.P$1 | U$6.3 89.18,58.72 U$6.P$4 | U$6.P28 88.01,55.09 U$6.P29 | U$6.P26 U$6.P25
  Top 1.016: MOTOROUT.3 95.09,54.77 92.08,57.78 90.05,57.78 U$6.P$2 | U$6.3 89.78,58.01 88.01,56.23 88.01,55.09 86.75,55.09
N$34
  Top 0.381: IR1.3 2.96,33.44 7C1.2 7R1.2
N$35
  Top 0.381: 7R1.1 8.89,36.41 7UP-R1.1 8.47,39.37 10.16,39.37 10.16,41.49 7R3.1 7.2,44.45 7UP-R2.1
  Top 0.508: 10.16,39.37 VSELECT.2
N$36
  Top 0.254: U$2.P15 22.11,5.82 R1.1
N$37
  Top 0.254: DPOT-SPI.3 81.28,6.86 81.28,11.43 83.19,13.34 U$3.1
N$38
  Top 0.254: DPOT-SPI.2 82.09,5.38 82.09,10.09 83.82,11.82 83.82,12.06 U$3.2
N$39
  Top 0.254: DPOT-SPI.1 82.55,9.53 83.82,10.79 U$3.3
N$40
  Top 0.254: U$2.P13 22.23,3.69 J1.6
N$41
  Top 0.381: 7R2.2 11.01,35.56 7C2.1 14.82,34.29 17.78,34.29 17.78,35.43 IR/OUT.2
N$42
  Top 0.254: U$2.P12 16.77,5.88 R2.1 19.47,3.17 J1.5
N$43
  Top 0.381: IR2.3 2.96,41.06 7C3.2 7R3.2
N$44
  Top 0.381: 7R4.2 11.43,45.3 7C4.1 17.91,45.72 IR/OUT.4
N$45
  Top 0.254: U$2.P11 16.05,6.3 16.05,5.08 17.14,3.98 J1.4
N$46
  Top 0.254: U$2.P10 14.61,5.96 J1.3
N$47
  Top 0.254: U$2.P9 12.06,6.72 J1.2
N$48
  Top 0.254: C4.2 C3.2 21.22,19.1 U$2.P3
N$65
  Top 0.254: 1PT2.EMITTER 6.15,64.12 1R2.2 10.16,65.19 10.16,68.71 1/LS-SIG.4
N$66
  Top 0.254: 1PT3.EMITTER 5.68,73.48 1R3.2 10.71,71.54 1/LS-SIG.3
N$67
  Top 0.254: 1PT4.EMITTER 7.39,83.17 1R4.2 10.29,80.73 10.29,76.94 11.3,75.93 1/LS-SIG.2
N$68
  Top 0.254: 1PT5.EMITTER 7.39,90.79 1R5.2 11.56,87.08 1/LS-SIG.1
N$69
  Top 0.254: 1PT1.EMITTER 6.55,52.69 1R1.2 11.56,57.7 1/LS-SIG.5
NRESET
  Top 0.254: J1.1 9.53,4.87 R3.2 8.89,5.68 8.06,6.51 8.06,15.24 11.84,19.02 12.73,19.02 13.71,18.04 U$2.P7
PWM
  Bottom 0.254: DRIVER-IO.1 6R6.1 93.13,53.76 93.98,54.61 6C1.1
SOLENOID-
  Top 1.016: 4RSNUB.2 71.06,38.1 | 71.06,38.1 4D2.A | 4MOS2.2 65.79,35.31 65.79,35.73 66.89,36.84 69.8,36.84 71.06,38.1
  Top 1.27: 4D2.A 81.92,38.1 85.09,41.27 93.34,41.27 SOLENOIDOUT.1
SOLENOIDON  (via drill 0.35)
  Top 0.254: 4MOS1.1 59.27,36.46 4DOWN-R1.2 59.27,38.95 v59.69,39.37 | v62.87,39.37 65.41,39.37 76.2,50.16 DRIVER-IO.7
  Bottom 0.254: v59.69,39.37 v62.87,39.37
VCC_1
  Top 0.254: 90.17,27.3 91.44,26.04 3R1.2
  Top 1.27: 3D1.C 81.28,30.14 4D1.A 83.19,27.3 90.17,27.3 91.44,27.3 94.61,27.3 | SOLENOIDOUT.3 95.72,27.3 94.61,27.3 | 94.61,27.3 96.52,25.4 CAPACITOR.1

### Text on the board
tPlace: 3v3 | gnd | 5v | gnd | 12v | enA | enB | inA | inB | cs | pwm | soleON | ir2 | 5v | raw | sole- | ir1 | 3v3 | raw | 60v | 60v | gnd | reset | mot | sclk | mosi | miso | ss | cs | sclk | mosi